# Altium schematic sheet PowerBoard V04.SchDoc
size A2
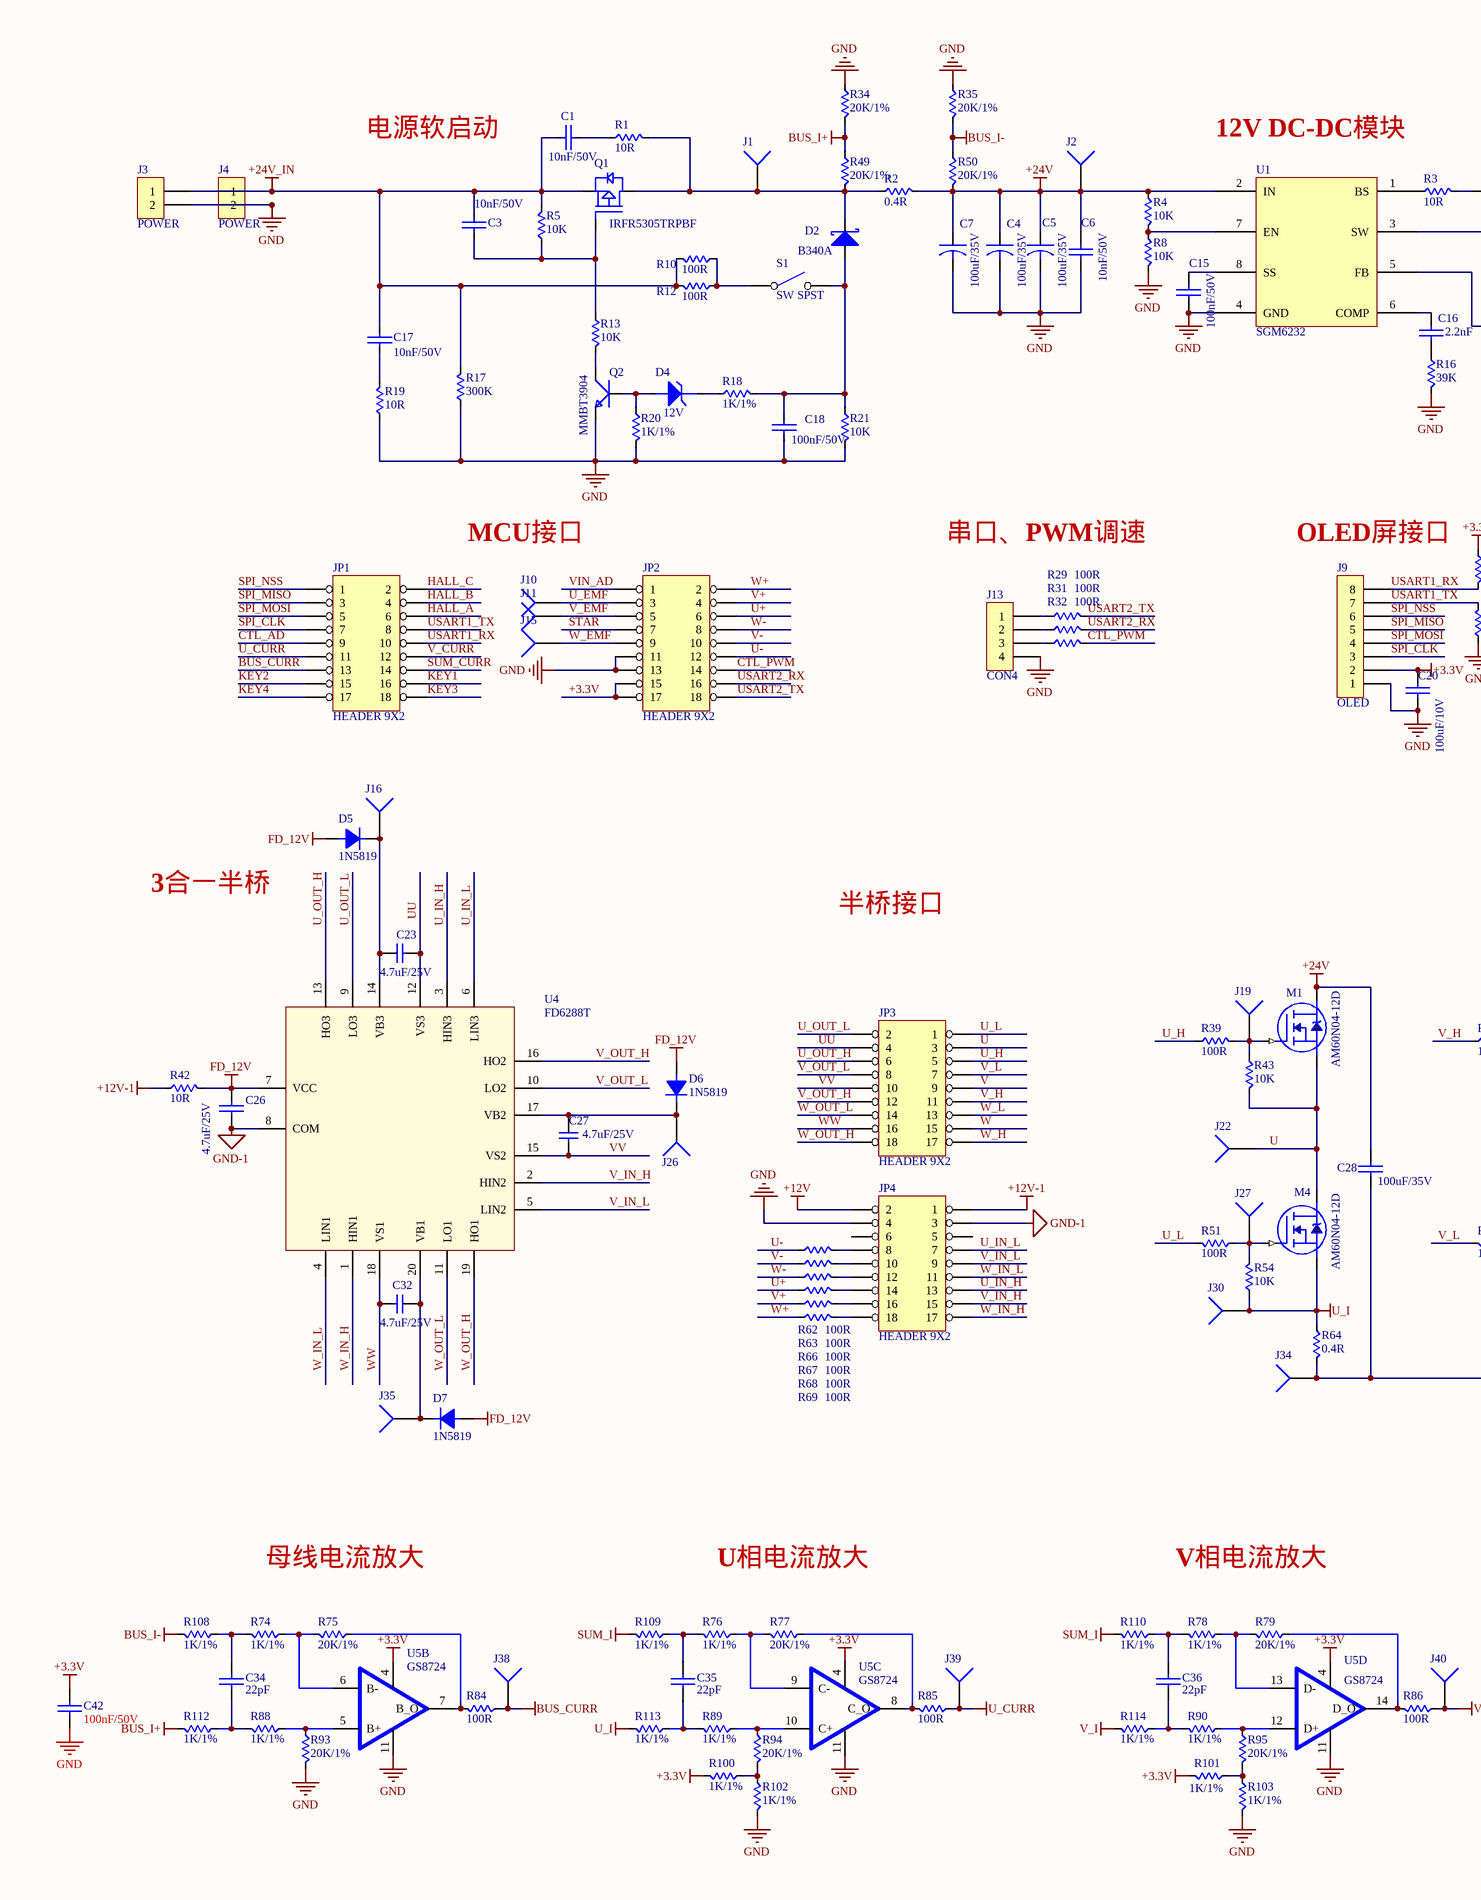
[diagram p0: PowerBoard V04.SchDoc, left]
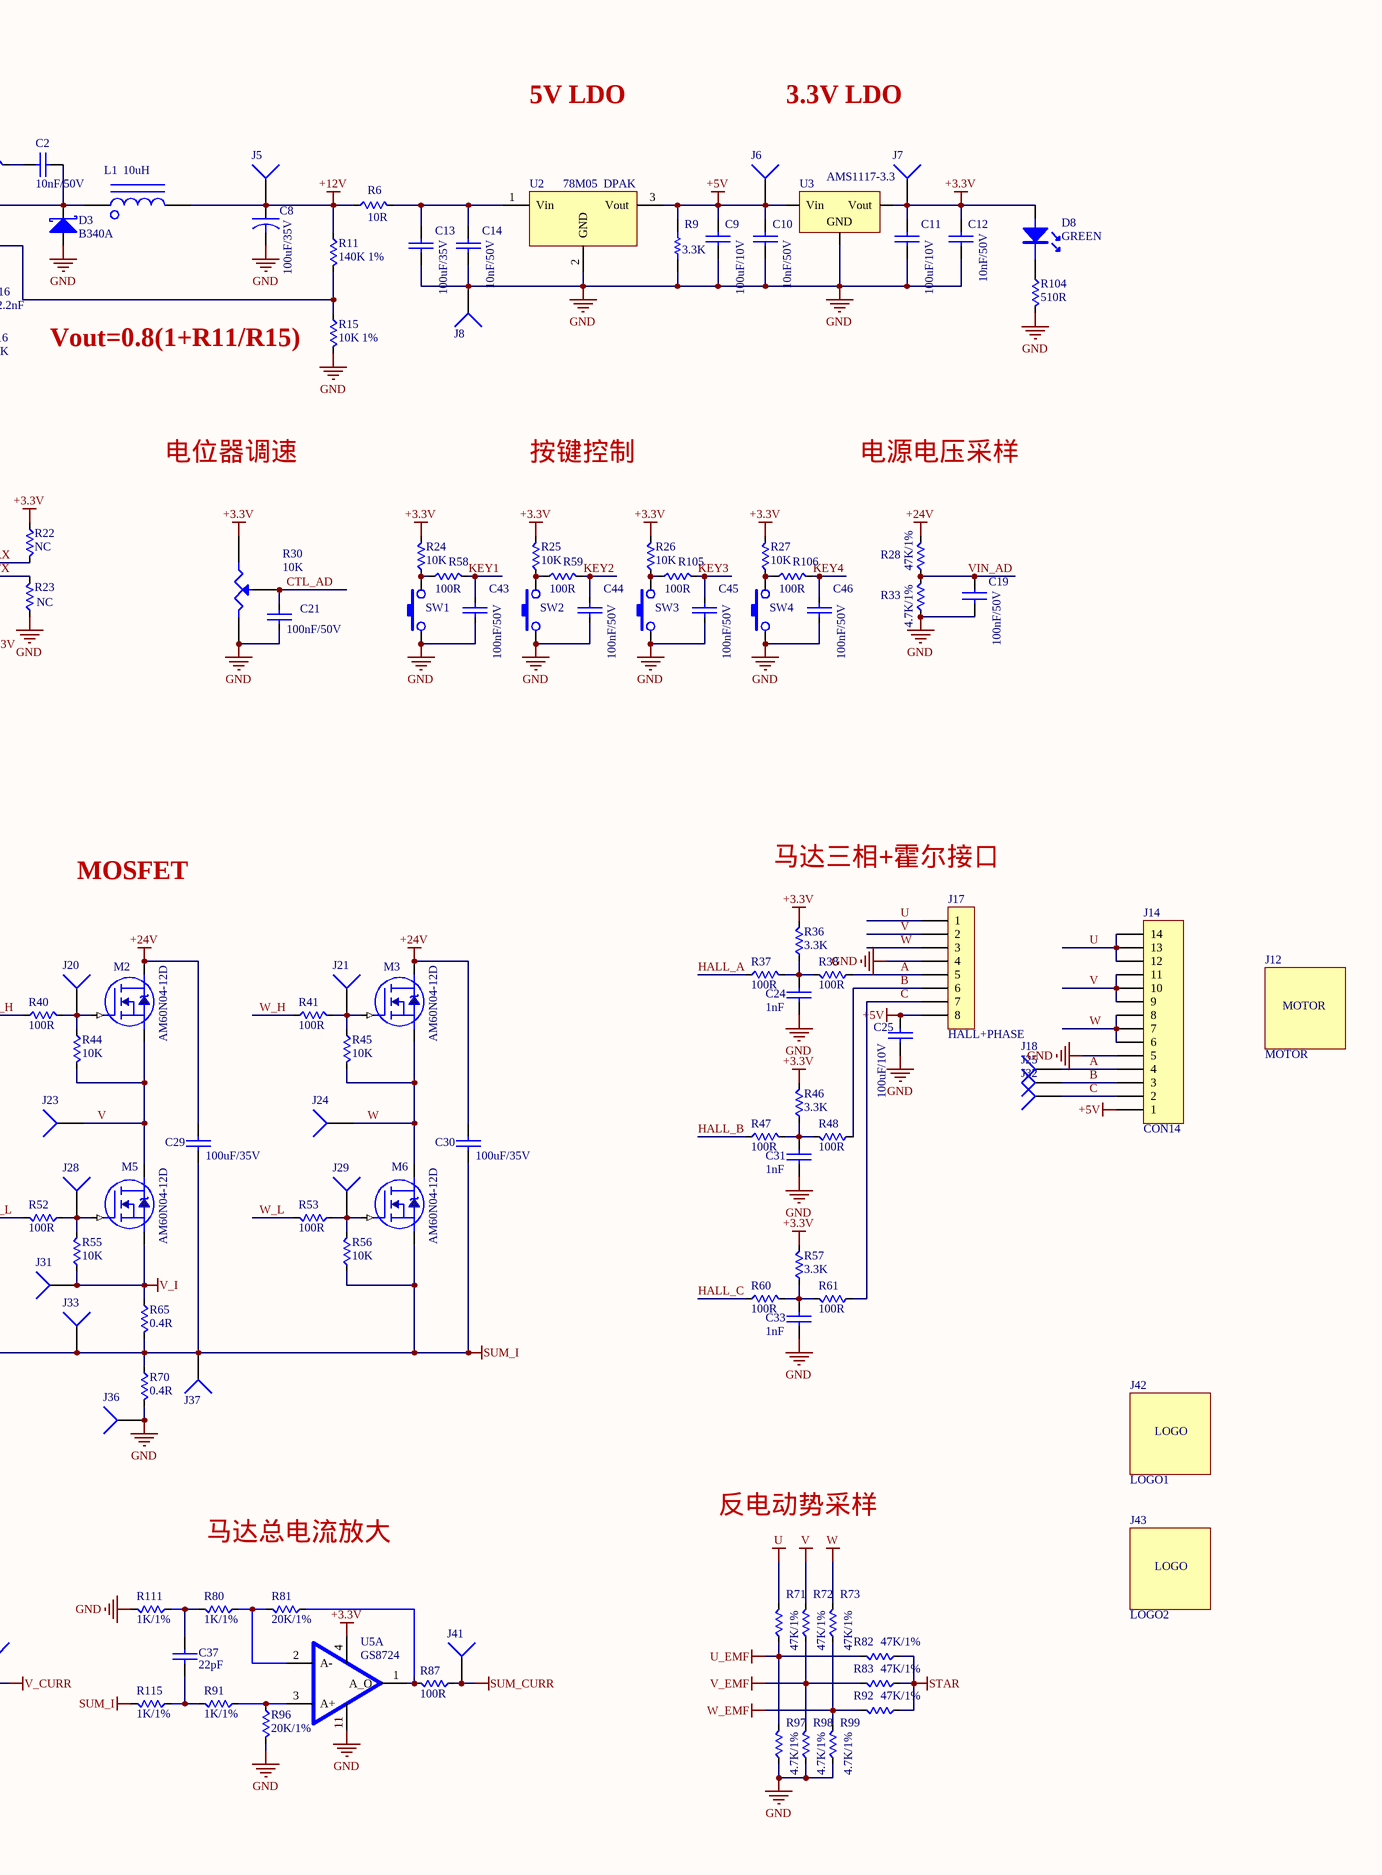
[diagram p1: PowerBoard V04.SchDoc, right]

## Parts
C1  10nF/50V  [0603C]
C2  10nF/50V  [0603C]
C3  10nF/50V  [0603C]
C4  100uF/35V  [SMD-D]
C5  100uF/35V  [SMD-D]
C6  10nF/50V  [0603C]
C7  100uF/35V  [SMD-D]
C8  100uF/35V  [SMD-D]
C9  100uF/10V  [SMD-C]
C10  10nF/50V  [0603C]
C11  100uF/10V  [SMD-C]
C12  10nF/50V  [0603C]
C13  100uF/35V  [SMD-D]
C14  10nF/50V  [0603C]
C15  100nF/50V  [0603C]
C16  2.2nF  [0603C]
C17  10nF/50V  [0603C]
C18  100nF/50V  [0603C]
C19  100nF/50V  [0603C]
C20  100uF/10V  [SMD-C]
C21  100nF/50V  [0603C]
C23  4.7uF/25V  [0805C]
C24  1nF  [0603C]
C25  100uF/10V  [SMD-C]
C26  4.7uF/25V  [0805C]
C27  4.7uF/25V  [0805C]
C28  100uF/35V  [SMD-D]
C29  100uF/35V  [SMD-D]
C30  100uF/35V  [SMD-D]
C31  1nF  [0603C]
C32  4.7uF/25V  [0805C]
C33  1nF  [0603C]
C34  22pF  [0603C]
C35  22pF  [0603C]
C36  22pF  [0603C]
C37  22pF  [0603C]
C42  100nF/50V  [0603C]
C43  100nF/50V  [0603C]
C44  100nF/50V  [0603C]
C45  100nF/50V  [0603C]
C46  100nF/50V  [0603C]
D2  B340A  [DO214AC(SMA)]
D3  B340A  [DO214AC(SMA)]
D4  12V  [SOD-123]
D5  1N5819  [SOD-123]
D6  1N5819  [SOD-123]
D7  1N5819  [SOD-123]
D8  GREEN  [0603D]
J1  (no value)  [PLUG]
J2  (no value)  [PLUG]
J3  POWER  [DC]
J4  POWER  [HEADER 1X2 3.96]
J5  (no value)  [PLUG]
J6  (no value)  [PLUG]
J7  (no value)  [PLUG]
J8  (no value)  [PLUG]
J9  OLED  [1.8_SPI_TFT_NC]
J10  (no value)  [PLUG]
J11  (no value)  [PLUG]
J12  MOTOR  [HALL_MOTOR]
J13  CON4  [SIP4]
J14  CON14  [FPC_XF2M-1415-1A]
J15  (no value)  [PLUG]
J16  (no value)  [PLUG]
J17  HALL+PHASE  [HEADER 1X8 3.96]
J18  (no value)  [PLUG]
J19  (no value)  [PLUG]
J20  (no value)  [PLUG]
J21  (no value)  [PLUG]
J22  (no value)  [PLUG]
J23  (no value)  [PLUG]
J24  (no value)  [PLUG]
J25  (no value)  [PLUG]
J26  (no value)  [PLUG]
J27  (no value)  [PLUG]
J28  (no value)  [PLUG]
J29  (no value)  [PLUG]
J30  (no value)  [PLUG]
J31  (no value)  [PLUG]
J32  (no value)  [PLUG]
J33  (no value)  [PLUG]
J34  (no value)  [PLUG]
J35  (no value)  [PLUG]
J36  (no value)  [PLUG]
J37  (no value)  [PLUG]
J38  (no value)  [PLUG]
J39  (no value)  [PLUG]
J40  (no value)  [PLUG]
J41  (no value)  [PLUG]
J42  LOGO1  [LOGO-ZHANGFEI]
J43  LOGO2  [LOGO_WENWEN]
JP1  HEADER 9X2  [SMT2.54-2X9-F]
JP2  HEADER 9X2  [SMT2.54-2X9-F]
JP3  HEADER 9X2  [SMT2.54-2X9-M]
JP4  HEADER 9X2  [SMT2.54-2X9-M]
L1  10uH  [CSAB0730-220M]
M1  AM60N04-12D  [DPAK]
M2  AM60N04-12D  [DPAK]
M3  AM60N04-12D  [DPAK]
M4  AM60N04-12D  [DPAK]
M5  AM60N04-12D  [DPAK]
M6  AM60N04-12D  [DPAK]
Q1  IRFR5305TRPBF  [DPAK]
Q2  MMBT3904  [SOT-23A]
R1  10R  [0603R]
R2  0.4R  [2512S]
R3  10R  [0603R]
R4  10K  [0603R]
R5  10K  [0603R]
R6  10R  [1206R]
R8  10K  [0603R]
R9  3.3K  [0603R]
R10  100R  [1206R]
R11  140K 1%  [0603r]
R12  100R  [1206R]
R13  10K  [0603R]
R15  10K 1%  [0603R]
R16  39K  [0603R]
R17  300K  [0603R]
R18  1K/1%  [0603R]
R19  10R  [0603R]
R20  1K/1%  [0603R]
R21  10K  [0603R]
R22  NC  [0603R]
R23  NC  [0603R]
R24  10K  [0603R]
R25  10K  [0603R]
R26  10K  [0603R]
R27  10K  [0603R]
R28  47K/1%  [0603R]
R29  100R  [0603R]
R30  10K  [B10K-9MM]
R31  100R  [0603R]
R32  100R  [0603R]
R33  4.7K/1%  [0603R]
R34  20K/1%  [0603R]
R35  20K/1%  [0603R]
R36  3.3K  [0603R]
R37  100R  [0603R]
R38  100R  [0603R]
R39  100R  [0603R]
R40  100R  [0603R]
R41  100R  [0603R]
R42  10R  [1206r]
R43  10K  [0603R]
R44  10K  [0603R]
R45  10K  [0603R]
R46  3.3K  [0603R]
R47  100R  [0603R]
R48  100R  [0603R]
R49  20K/1%  [0603R]
R50  20K/1%  [0603R]
R51  100R  [0603R]
R52  100R  [0603R]
R53  100R  [0603R]
R54  10K  [0603R]
R55  10K  [0603R]
R56  10K  [0603R]
R57  3.3K  [0603R]
R58  100R  [0603R]
R59  100R  [0603R]
R60  100R  [0603R]
R61  100R  [0603R]
R62  100R  [0603R]
R63  100R  [0603R]
R64  0.4R  [2512S]
R65  0.4R  [2512S]
R66  100R  [0603R]
R67  100R  [0603R]
R68  100R  [0603R]
R69  100R  [0603R]
R70  0.4R  [2512S]
R71  47K/1%  [0603R]
R72  47K/1%  [0603R]
R73  47K/1%  [0603R]
R74  1K/1%  [0603R]
R75  20K/1%  [0603R]
R76  1K/1%  [0603R]
R77  20K/1%  [0603R]
R78  1K/1%  [0603R]
R79  20K/1%  [0603R]
R80  1K/1%  [0603R]
R81  20K/1%  [0603R]
R82  47K/1%  [0603R]
R83  47K/1%  [0603R]
R84  100R  [0603R]
R85  100R  [0603R]
R86  100R  [0603R]
R87  100R  [0603R]
R88  1K/1%  [0603R]
R89  1K/1%  [0603R]
R90  1K/1%  [0603R]
R91  1K/1%  [0603R]
R92  47K/1%  [0603R]
R93  20K/1%  [0603R]
R94  20K/1%  [0603R]
R95  20K/1%  [0603R]
R96  20K/1%  [0603R]
R97  4.7K/1%  [0603R]
R98  4.7K/1%  [0603R]
R99  4.7K/1%  [0603R]
R100  1K/1%  [0603R]
R101  1K/1%  [0603R]
R102  1K/1%  [0603R]
R103  1K/1%  [0603R]
R104  510R  [0603R]
R105  100R  [0603R]
R106  100R  [0603R]
R108  1K/1%  [0603R]
R109  1K/1%  [0603R]
R110  1K/1%  [0603R]
R111  1K/1%  [0603R]
R112  1K/1%  [0603R]
R113  1K/1%  [0603R]
R114  1K/1%  [0603R]
R115  1K/1%  [0603R]
S1  SW SPST  [SW 2P2T]
SW1  SW_SW1  [SW6.5*4.5-SMD]  (value not drawn)
SW2  SW_SW1  [SW6.5*4.5-SMD]  (value not drawn)
SW3  SW_SW1  [SW6.5*4.5-SMD]  (value not drawn)
SW4  SW_SW1  [SW6.5*4.5-SMD]  (value not drawn)
U1  SGM6232  [SO-8B]
U2  78M05  DPAK  [DPAK]
U3  AMS1117-3.3  [SOT-223A]
U4  FD6288T  [TSSOP-20]
U5  GS8724  [SO-14A]  (parts A,B,C,D of 4)

## Nets
+3.3V: C11.1 C12.1 C20.1 C42.2 D8.1 J7.1 J9.2 JP2.15 JP2.17 R22.2 R24.1 R25.1 R26.1 R27.1 R30.3 R36.2 R46.2 R57.2 R100.2 R101.2 U3.2(Vout) U5.4(VS+)
+5V: C9.1 C10.1 C25.1 J6.1 J14.1 J17.8 R9.2 U2.3(Vout) U3.3(Vin)
+12V: C8.1 J5.1 JP4.2 L1.2 R6.1 R11.1
+12V-1: JP4.1 R42.1
+24V: C4.1 C5.1 C6.1 C7.1 C28.1 C29.1 C30.1 J2.1 M1.2(DRAIN) M2.2(DRAIN) M3.2(DRAIN) R2.2 R4.1 R28.1 R50.2 U1.2(IN)
+24V_IN: C1.1 C3.2 C17.2 J3.1 J4.1 Q1.3(S) R5.2 R10.2 R12.2 R17.2
BUS_CURR: J38.1 JP1.13 R84.1
BUS_I+: R34.2 R49.1 R112.2
BUS_I-: R35.2 R50.1 R108.2
FD_12V: C26.1 D5.1 D6.1 D7.1 R42.2 U4.7(VCC)
GND: C4.2 C5.2 C6.2 C7.2 C8.2 C9.2 C10.2 C11.2 C12.2 C13.2 C14.2 C15.2 C18.2 C19.2 C20.2 C21.2 C24.2 C25.2 C31.2 C33.2 C42.1 C43.2 C44.2 C45.2 C46.2 D3.1 J3.2 J4.2 J8.1 J9.1 J13.4 J14.5 J17.4 J36.1 JP2.11 JP2.13 JP4.4 Q2.2(E) R8.2 R9.1 R15.2 R16.2 R17.1 R19.1 R20.2 R21.2 R23.2 R30.1 R33.2 R34.1 R35.1 R70.2 R93.2 R96.2 R97.1 R98.1 R99.1 R102.2 R103.2 R104.2 R111.2 SW1.1 SW2.1 SW3.1 SW4.1 U1.4(GND) U2.2(GND) U3.1(GND) U5.11(VS-)
GND-1: C26.2 JP4.3 U4.8(COM)
STAR: JP2.7 R82.1 R83.1 R92.1
SUM_CURR: J41.1 JP1.14 R87.1
SUM_I: C28.2 C29.2 C30.2 J33.1 J34.1 J37.1 M6.3(SOURCE) R56.1 R64.2 R65.2 R70.1 R109.2 R110.2 R115.2
U: J14.12 J14.13 J14.14 J17.1 J22.1 JP3.3 M1.3(SOURCE) M4.2(DRAIN) R43.2 R71.2
U_CURR: J39.1 JP1.11 R85.1
U_EMF: J10.1 JP2.3 R71.1 R82.2 R97.2
U_I: J30.1 M4.3(SOURCE) R54.1 R64.1 R113.2
V: J14.9 J14.10 J14.11 J17.2 J23.1 JP3.9 M2.3(SOURCE) M5.2(DRAIN) R44.2 R72.2
V_CURR: J40.1 JP1.12 R86.1
V_EMF: J11.1 JP2.5 R72.1 R83.2 R98.2
V_I: J31.1 M5.3(SOURCE) R55.1 R65.1 R114.2
W: J14.6 J14.7 J14.8 J17.3 J24.1 JP3.15 M3.3(SOURCE) M6.2(DRAIN) R45.2 R73.2
W_EMF: J15.1 JP2.9 R73.1 R92.2 R99.2
A: J14.4 J17.5 J18.1 R38.1
B: J14.3 J17.6 J25.1 R48.1
C: J14.2 J17.7 J32.1 R61.1
CTL_AD: C21.1 JP1.9 R30.2
CTL_PWM: JP2.14 R32.2
HALL_A: JP1.6 R37.1
HALL_B: JP1.4 R47.1
HALL_C: JP1.2 R60.1
KEY1: C43.1 JP1.16 R58.2
KEY2: C44.1 JP1.15 R59.2
KEY3: C45.1 JP1.18 R105.2
KEY4: C46.1 JP1.17 R106.2
SPI_CLK: J9.3 JP1.7
SPI_MISO: J9.5 JP1.3
SPI_MOSI: J9.4 JP1.5
SPI_NSS: J9.6 JP1.1
U+: JP2.6 R67.1
U-: JP2.12 R62.1
U_H: JP3.5 R39.1
U_IN_H: JP4.13 U4.3(HIN3)
U_IN_L: JP4.7 U4.6(LIN3)
U_L: JP3.1 R51.2
U_OUT_H: JP3.6 U4.13(HO3)
U_OUT_L: JP3.2 U4.9(LO3)
USART1_RX: J9.8 JP1.10 R22.1
USART1_TX: J9.7 JP1.8 R23.1
USART2_RX: JP2.16 R31.2
USART2_TX: JP2.18 R29.2
UU: C23.2 JP3.4 U4.12(VS3)
V+: JP2.4 R68.1
V-: JP2.10 R63.1
V_H: JP3.11 R40.1
V_IN_H: JP4.15 U4.2(HIN2)
V_IN_L: JP4.9 U4.5(LIN2)
V_L: JP3.7 R52.2
V_OUT_H: JP3.12 U4.16(HO2)
V_OUT_L: JP3.8 U4.10(LO2)
VIN_AD: C19.1 JP2.1 R28.2 R33.1
VV: C27.2 JP3.10 U4.15(VS2)
W+: JP2.2 R69.1
W-: JP2.8 R66.1
W_H: JP3.17 R41.1
W_IN_H: JP4.17 U4.1(HIN1)
W_IN_L: JP4.11 U4.4(LIN1)
W_L: JP3.13 R53.2
W_OUT_H: JP3.18 U4.19(HO1)
W_OUT_L: JP3.14 U4.11(LO1)
WW: C32.2 JP3.16 U4.18(VS1)
NetC1_2: C1.2 R1.1
NetC2_1: C2.1 R3.2
NetC2_2: C2.2 D3.2 L1.1 U1.3(SW)
NetC3_1: C3.1 Q1.1(G) R5.1 R13.1
NetC13_1: C13.1 C14.1 R6.2 U2.1(Vin)
NetC15_1: C15.1 U1.8(SS)
NetC16_1: C16.1 U1.6(COMP)
NetC16_2: C16.2 R16.1
NetC17_1: C17.1 R19.2
NetC18_1: C18.1 D2.1 R18.2 R21.1 S1.2(NO)
NetC23_1: C23.1 D5.2 J16.1 U4.14(VB3)
NetC24_1: C24.1 R36.1 R37.2 R38.2
NetC27_1: C27.1 D6.2 J26.1 U4.17(VB2)
NetC31_1: C31.1 R46.1 R47.2 R48.2
NetC32_1: C32.1 D7.2 J35.1 U4.20(VB1)
NetC33_1: C33.1 R57.1 R60.2 R61.2
NetC34_1: C34.1 R74.2 R108.1
NetC34_2: C34.2 R88.2 R112.1
NetC35_1: C35.1 R76.2 R109.1
NetC35_2: C35.2 R89.2 R113.1
NetC36_1: C36.1 R78.2 R110.1
NetC36_2: C36.2 R90.2 R114.1
NetC37_1: C37.1 R80.2 R111.1
NetC37_2: C37.2 R91.2 R115.1
NetD2_2: D2.2 J1.1 Q1.2(D) R1.2 R2.1 R49.2
NetD4_1: D4.1(A) Q2.1(B) R20.1
NetD4_2: D4.2(K) R18.1
NetD8_2: D8.2 R104.1
NetJ13_1: J13.1 R29.1
NetJ13_2: J13.2 R31.1
NetJ13_3: J13.3 R32.1
NetJ19_1: J19.1 M1.1(GATE) R39.2 R43.1
NetJ20_1: J20.1 M2.1(GATE) R40.2 R44.1
NetJ21_1: J21.1 M3.1(GATE) R41.2 R45.1
NetJ27_1: J27.1 M4.1(GATE) R51.1 R54.2
NetJ28_1: J28.1 M5.1(GATE) R52.1 R55.2
NetJ29_1: J29.1 M6.1(GATE) R53.1 R56.2
NetJP4_8: JP4.8 R62.2
NetJP4_10: JP4.10 R63.2
NetJP4_12: JP4.12 R66.2
NetJP4_14: JP4.14 R67.2
NetJP4_16: JP4.16 R68.2
NetJP4_18: JP4.18 R69.2
NetQ2_3: Q2.3(C) R13.2
NetR3_1: R3.1 U1.1(BS)
NetR4_2: R4.2 R8.1 U1.7(EN)
NetR10_1: R10.1 R12.1 S1.1(COMMON)
NetR11_2: R11.2 R15.1 U1.5(FB)
NetR24_2: R24.2 R58.1 SW1.2
NetR25_2: R25.2 R59.1 SW2.2
NetR26_2: R26.2 R105.1 SW3.2
NetR27_2: R27.2 R106.1 SW4.2
NetR74_1: R74.1 R75.2 U5.6(B-)
NetR75_1: R75.1 R84.2 U5.7(B_O)
NetR76_1: R76.1 R77.2 U5.9(C-)
NetR77_1: R77.1 R85.2 U5.8(C_O)
NetR78_1: R78.1 R79.2 U5.13(D-)
NetR79_1: R79.1 R86.2 U5.14(D_O)
NetR80_1: R80.1 R81.2 U5.2(A-)
NetR81_1: R81.1 R87.2 U5.1(A_O)
NetR88_1: R88.1 R93.1 U5.5(B+)
NetR89_1: R89.1 R94.1 U5.10(C+)
NetR90_1: R90.1 R95.1 U5.12(D+)
NetR91_1: R91.1 R96.1 U5.3(A+)
NetR94_2: R94.2 R100.1 R102.1
NetR95_2: R95.2 R101.1 R103.1

Not connected (* = marked no-connect by the designer): JP4 5 6

## Notes on the sheet
- 电源软启动
- (near U1) 12V DC-DC模块
- 5V LDO
- 3.3V LDO
- (near R15) Vout=0.8(1+R11/R15)
- 电位器调速
- 按键控制
- 电源电压采样
- MCU接口
- 串口、PWM调速
- (near J9) OLED屏接口
- 3合一半桥
- MOSFET
- 马达三相+霍尔接口
- 半桥接口
- 母线电流放大
- U相电流放大
- V相电流放大
- 马达总电流放大
- 反电动势采样

## Library data of the parts
C1-C3 C6 C9-C18 C20 C21 C24-C26 C28-C31 C33-C37 C42-C46 = CAP: Capacitor
C4 C5 C7 C8 = CAPACITOR
C19 = CAP NP: Y02-02238; Text Field1: 20; Text Field2: 10
C23 C27 C32 = CAP
D2 D3 = DIODE SCHOTTKY: Schottky Diode
D4 = ZENER3: Zener Diode
D5-D7 = DIODE
D8 = LED: Y02-01665
J1 J2 J5-J8 J10 J11 J15 J16 J18-J41 = Socket: Plug; LatestRevisionDate: 17-Jul-2002; LatestRevisionNote: Re-released for DXP Platform.; Publisher: Altium Limited
J3 J4 = CON2: Connector
J9 J17 = CON8: Connector
J13 = CON4: Connector
J14 = CON14: Connector
J42 J43 = LOGO
L1 = INDUCTOR IRON1
M1-M6 = MOSFEN: Low Charge N-Channel MOSFET
Q1 = MOSFET P
Q2 = NPN(BEC): NPN
R1-R4 R6 R8 R10-R13 R15-R21 R24-R27 R34 R35 R42 R49 R50 R62-R70 R74-R81 R84-R91 R93-R96 R100-R103 R108-R115 = RES
R5 R29 R31 R32 R36-R41 R43-R48 R51-R61 R105 R106 = Res
R9 = Res Semi: Semiconductor Resistor; Manufacturer: Generic Components; Class: Passive; Value: 0.125W; Published: 08/06/2000; Publisher: Altium Hobart Technology Centre; SubClass: Resistor; Package: 0805
R22 R28 R71-R73 R82 R83 R92 = RES: Y02-00588
R23 R33 R97-R99 = RES: Y02-01715
R30 = POT1: Potentiometer
R104 = RES: Y02-00493
SW1-SW4 = SW_SW1: 轻触按键
U2 = VOLTREG
U3 = Volt Reg: Voltage Regulator; Published: *; LatestRevisionDate: *; LatestRevisionNote: *; PackageReference: *; Publisher: *; Code_JEDEC: *
U5 = TP2274